# Altium schematic sheet ESP_Controller.SchDoc
size A4; SheetNumber: 1; SheetTotal: 4; SPICEModelCacheITBBTXQH: <root> / <DocumentId>ITBBTXQH</DocumentId> / </root>
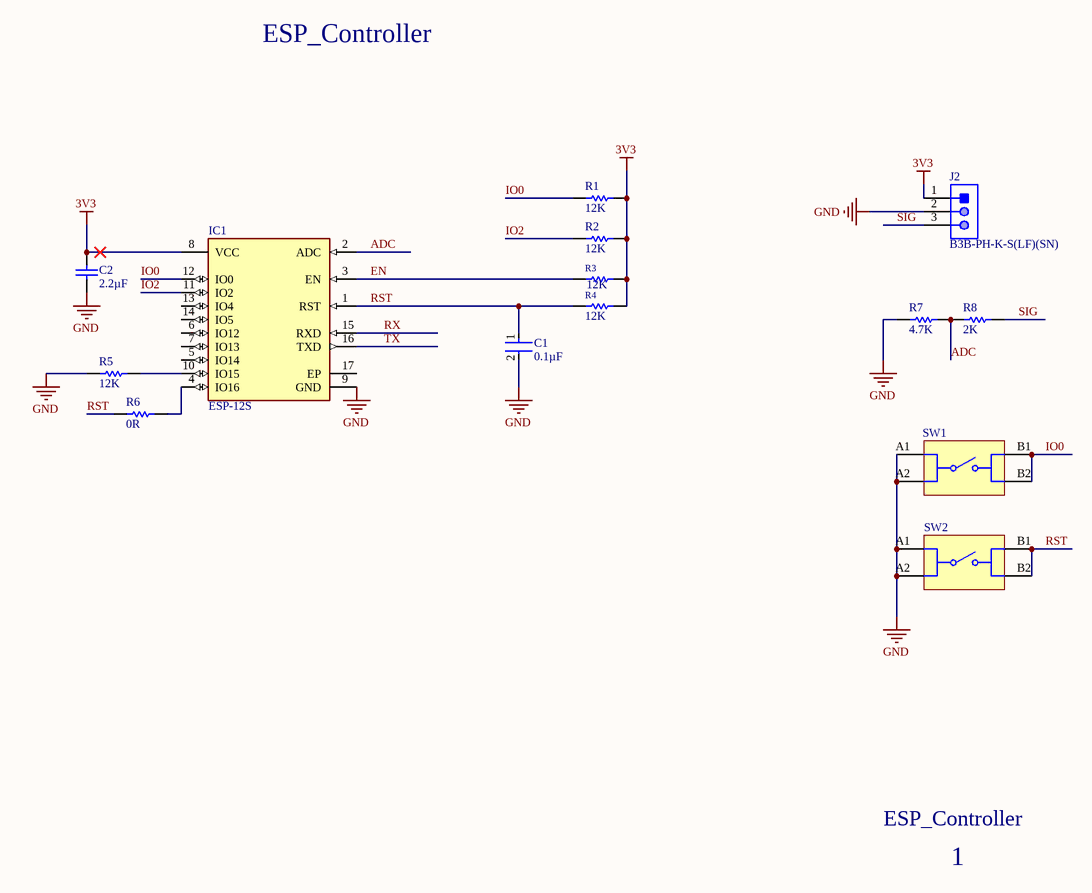
[diagram p0: ESP_Controller.SchDoc]

## Parts
C1  0.1µF  [FP-CC0603-DA-MFG]
C2  2.2µF  [CAPC2013X145X50ML20T25]
IC1  ESP-12S  [FP-ESP-12S-MFG]
J2  B3B-PH-K-S(LF)(SN)  [JST-B3B-PH-K-S-3_V]
R1  12K  [RESC2013X70X40ML20T20]
R2  12K  [RESC2013X70X40ML20T20]
R3  12K  [RESC2013X70X40ML20T20]
R4  12K  [RESC2013X70X40ML20T20]
R5  12K  [RESC2013X70X40ML20T20]
R6  0R  [RESC2013X70X40NL20T20]
R7  4.7K  [RESC2013X60X40ML20T25]
R8  2K  [RESC2013X60X40ML20T25]
SW1  430773051825  [430773051825]  (value not drawn)
SW2  430773051825  [430773051825]  (value not drawn)

## Nets
3V3: C2.2 IC1.8(VCC) J2.1 R1.2 R2.2 R3.2 R4.2
GND: C1.2 C2.1 IC1.9(GND) J2.2 R5.1 R7.1 SW1.A1 SW1.A2 SW2.A1 SW2.A2
ADC: IC1.2(ADC) R7.2 R8.1
EN: IC1.3(EN) R3.1
IO0: IC1.12(IO0) R1.1 SW1.B1 SW1.B2
IO2: IC1.11(IO2) R2.1
RST: C1.1 IC1.1(RST) R4.1 R6.1 SW2.B1 SW2.B2
RX: IC1.15(RXD)
SIG: J2.3 R8.2
TX: IC1.16(TXD)
NetIC1_4: IC1.4(IO16) R6.2
NetIC1_10: IC1.10(IO15) R5.2

Not connected (* = marked no-connect by the designer): IC1 5(IO14) 6(IO12) 7(IO13) 13(IO4) 14(IO5) 17(EP)

## Notes on the sheet
- ESP_Controller
- 1

## Library data of the parts
C1 = CMP-03422-001463-1: Capacitor Ceramic 0.1uF 6.3V X7R 10% 0603 Paper T/R; RoHS Compliant: Yes
C2 = CMP-1036-04819-2: Part Number: C0805C225K9PACTU; Manufacturer: Kemet
IC1 = CMP-204316-000002-1: RX TXRX MOD WIFI PCB TRACE SMD; Interface: I2C; Sensitivity: -90dBm; Data Rate: 54Mbps; Frequency: 2.484GHz; Series: -
J2 = CMP-2000-05164-1: Male Header, Pitch 2 mm, 1 x 3 Position, Height 6 mm, Tail Length 3.4 mm, -25 to 85 degC, RoHS, Bulk; Manufacturer: JST; Style/Orientation: StraightHeader/Plug; Pitch: 2mm; No of Positions: 3; Termination: Crimp; Manufacturer URL: http://www.jst.com/home2.html; Datasheet Version: Oct-06; Type: ShroudedHeader; Datasheet URL: https://datasheet.ciiva.com/11746/0900766b80826550-11746939.pdf
R1-R5 = CMP-2001-00347-1: Part Number: ERJ-6GEYJ123V; Manufacturer: Panasonic
R6 = CMP-1665-00002-5: Chip Resistor, 0 Ohm, +/- 1%, 0.125 W, -55 to 155 degC, 0805 (2012 Metric), RoHS, Tape and Reel; PartNumber: ERJ-6GEY0R00V; Tolerance: 5%; Resistance: 0 Ohm; REACH SVHC: No SVHC; Min Operating Temperature: -55 degC; Case/Package: 0805; Packaging: Tape and Reel; Package Quantity: 5000; ComponentLink1Description: Manufacturer URL; PackageDescription: 2-Pin Surface Mount Device, Body 2 x 1.25 mm; Mounting Technology: Surface Mount; Max Operating Temperature: 155 degC; Width: 1.25 mm; RoHSCompliant: True; Height: 0.6 mm; ComponentLink1URL: http://www.panasonic.com/; ComponentLink2URL: http://industrial.panasonic.com/cdbs/www-data/pdf/RDA0000/AOA0000C84.pdf; Case Code (Imperial): 0805; DatasheetVersion: 03/2015; Length: 2 mm; Case Code (Metric): 2012; ComponentLink2Description: Datasheet; Radiation Hardening: No
R7 = CMP-2001-00644-1: Part Number: ERA6AEB472V; Manufacturer: Panasonic
R8 = CMP-2001-00609-1: Part Number: ERA6AEB202V; Manufacturer: Panasonic
SW1 SW2 = CMP-03913-86984039-2: Tactile Switch, 0.05A, 12Vdc, 250Gf, Smd Rohs Compliant: Yes; Voltage Rating: 12V; Contact Resistance: 100mΩ; Contact Current Rating: 50mA; Life (Cycles): 500kcycles; Packaging: Tape and Reel; Insulation Resistance: 100MΩ; RoHS: Compliant; Min Operating Temperature: -40°C; Height: 5.1mm; Max Operating Temperature: 85°C; Mount: Surface Mount; Contact Plating: Silver; Current Rating: 50mA; Voltage Rating (DC): 12V